# Altium schematic sheet sheet.SchDoc
size A
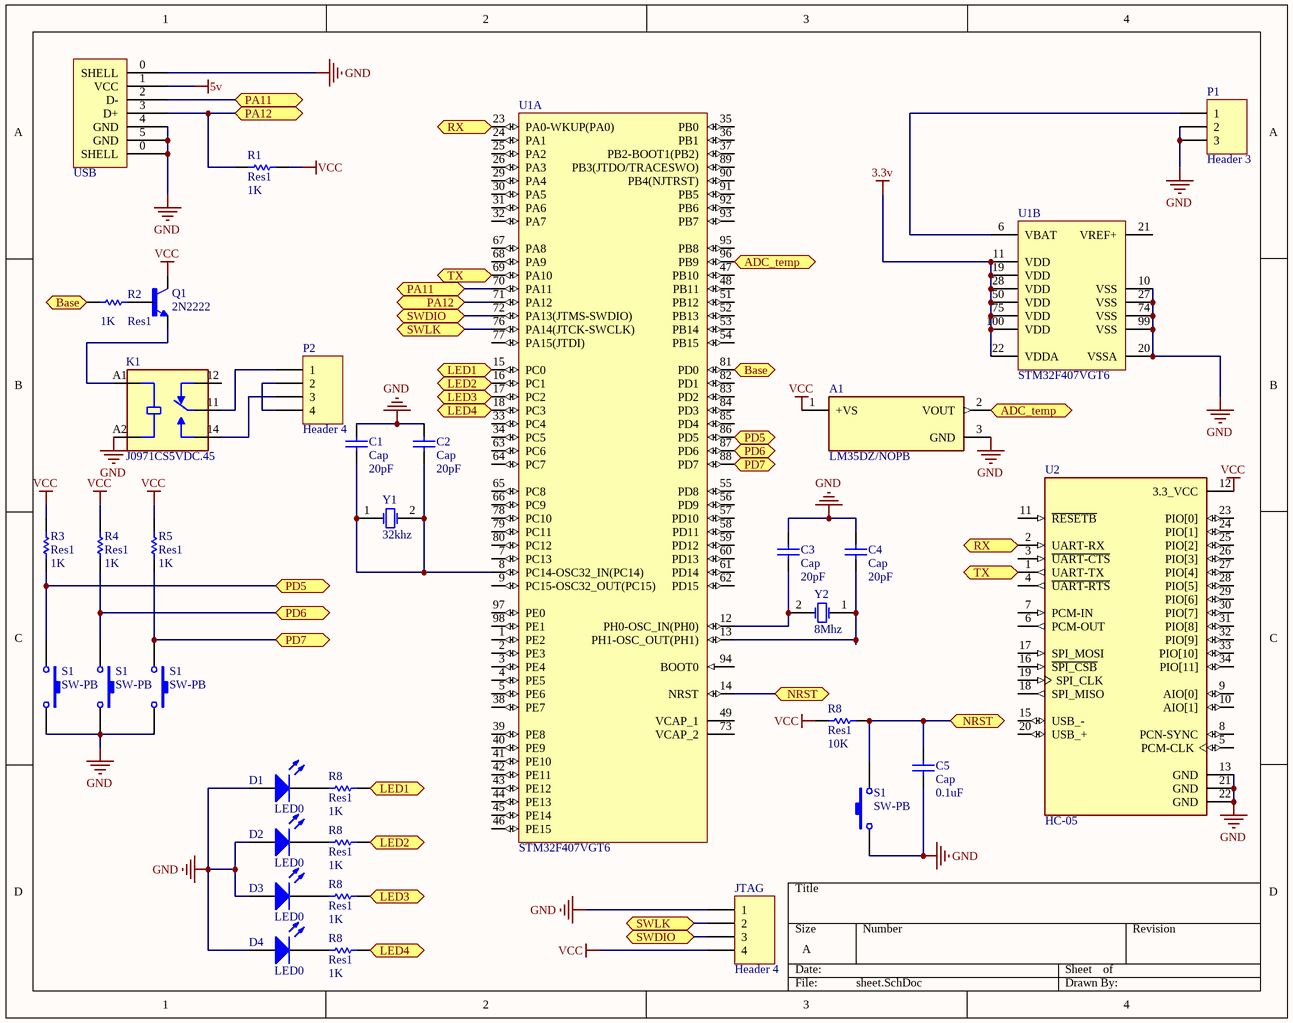
[diagram p0: sheet.SchDoc]

## Parts
(Parts that share a designator on the sheet are numbered #1, #2 ... from top to bottom, then left to right.)
A1  LM35DZ/NOPB  [TO92127P521H735-3]
C1  Cap  value 20pF  [RAD-0.3]
C2  Cap  value 20pF  [RAD-0.3]
C3  Cap  value 20pF  [RAD-0.3]
C4  Cap  value 20pF  [RAD-0.3]
C5  Cap  value 0.1uF  [RAD-0.3]
D1  LED0  [LED-0]
D2  LED0  [LED-0]
D3  LED0  [LED-0]
D4  LED0  [LED-0]
JTAG  Header 4  [HDR1X4]
K1  J0971CS5VDC.45  [RELAY_J0971CS5VDC.45]
P1  Header 3  [HDR1X3]
P2  Header 4  [HDR1X4]
Q1  2N2222  [TO127P584H533-3]
R1  Res1  value 1K  [AXIAL-0.3]
R2  Res1  value 1K  [AXIAL-0.3]
R3  Res1  value 1K  [AXIAL-0.3]
R4  Res1  value 1K  [AXIAL-0.3]
R5  Res1  value 1K  [AXIAL-0.3]
R8#1  Res1  value 10K  [AXIAL-0.3]
R8#2  Res1  value 1K  [AXIAL-0.3]
R8#3  Res1  value 1K  [AXIAL-0.3]
R8#4  Res1  value 1K  [AXIAL-0.3]
R8#5  Res1  value 1K  [AXIAL-0.3]
S1#1  SW-PB  [SPST-2]
S1#2  SW-PB  [SPST-2]
S1#3  SW-PB  [SPST-2]
S1#4  SW-PB  [SPST-2]
U1  STM32F407VGT6  [STM-LQFP100_N]  (parts A,B of 2)
U2  HC-05  [XCVR_HC-05]
USB  USB connector  [usb_B]  (value not drawn)
Y1  32khz  [R38]
Y2  8Mhz  [R38]

## Ports
ADC_temp, Base, LED1, LED2, LED3, LED4, NRST, PA11, PA12, PD5, PD6, PD7, RX, SWDIO, SWLK, TX

## Nets
3.3v: U1.11(VDD) U1.19(VDD) U1.22(VDDA) U1.28(VDD) U1.50(VDD) U1.75(VDD) U1.100(VDD)
5v: USB.1(VCC)
GND: A1.3(GND) C1.1 C2.1 C3.2 C4.2 C5.1 D1.1(A) D2.1(A) D3.1(A) D4.1(A) JTAG.1 K1.A2(COIL2) P1.2 P1.3 S1#1.2 S1#2.2 S1#3.2 S1#4.1 U1.10(VSS) U1.20(VSSA) U1.27(VSS) U1.74(VSS) U1.99(VSS) U2.13(GND) U2.21(GND) U2.22(GND) USB.0(SHELL) USB.4(GND) USB.5(GND)
VCC: A1.1(+VS) JTAG.4 Q1.3(C) R1.2 R3.2 R4.2 R5.2 R8#1.1 U2.12(3.3_VCC)
ADC_temp: A1.2(VOUT) U1.96(PB9) ; port ADC_temp
Base: R2.1 U1.81(PD0) ; port Base
LED1: R8#2.2 U1.15(PC0) ; port LED1
LED2: R8#3.2 U1.16(PC1) ; port LED2
LED3: R8#4.2 U1.17(PC2) ; port LED3
LED4: R8#5.2 U1.18(PC3) ; port LED4
NRST: C5.2 R8#1.2 S1#4.2 U1.14(NRST) ; port NRST
PA11: U1.70(PA11) USB.2(D-) ; port PA11
PA12: R1.1 U1.71(PA12) USB.3(D+) ; port PA12
PD5: R3.1 S1#1.1 U1.86(PD5) ; port PD5
PD6: R4.1 S1#2.1 U1.87(PD6) ; port PD6
PD7: R5.1 S1#3.1 U1.88(PD7) ; port PD7
RX: U1.23(PA0-WKUP(PA0)) U2.2(UART-RX) ; port RX
SWDIO: JTAG.3 U1.72(PA13(JTMS-SWDIO)) ; port SWDIO
SWLK: JTAG.2 U1.76(PA14(JTCK-SWCLK)) ; port SWLK
TX: U1.69(PA10) U2.1(UART-TX) ; port TX
NetC1_2: C1.2 C2.2 U1.8(PC14-OSC32_IN(PC14)) Y1.1(OSC1) Y1.2(OSC2)
NetC3_1: C3.1 U1.12(PH0-OSC_IN(PH0)) Y2.2(OSC2)
NetC4_1: C4.1 U1.13(PH1-OSC_OUT(PH1)) Y2.1(OSC1)
NetD1_2: D1.2(K) R8#2.1
NetD2_2: D2.2(K) R8#3.1
NetD3_2: D3.2(K) R8#4.1
NetD4_2: D4.2(K) R8#5.1
NetK1_11: K1.11(COM) P2.1
NetK1_14: K1.14(NO) P2.3
NetK1_A1: K1.A1(COIL1) Q1.1(E)
NetP1_1: P1.1 U1.6(VBAT)
NetP2_2: P2.2 P2.4
NetQ1_2: Q1.2(B) R2.2

Not connected (* = marked no-connect by the designer): K1 12(NC); U1 1(PE2) 2(PE3) 3(PE4) 4(PE5) 5(PE6) 7(PC13) 9(PC15-OSC32_OUT(PC15)) 21(VREF+) 24(PA1) 25(PA2) 26(PA3) 29(PA4) 30(PA5) 31(PA6) 32(PA7) 33(PC4) 34(PC5) 35(PB0) 36(PB1) 37(PB2-BOOT1(PB2)) 38(PE7) 39(PE8) 40(PE9) 41(PE10) 42(PE11) 43(PE12) 44(PE13) 45(PE14) 46(PE15) 47(PB10) 48(PB11) 49(VCAP_1) 51(PB12) 52(PB13) 53(PB14) 54(PB15) 55(PD8) 56(PD9) 57(PD10) 58(PD11) 59(PD12) 60(PD13) 61(PD14) 62(PD15) 63(PC6) 64(PC7) 65(PC8) 66(PC9) 67(PA8) 68(PA9) 73(VCAP_2) 77(PA15(JTDI)) 78(PC10) 79(PC11) 80(PC12) 82(PD1) 83(PD2) 84(PD3) 85(PD4) 89(PB3(JTDO/TRACESWO)) 90(PB4(NJTRST)) 91(PB5) 92(PB6) 93(PB7) 94(BOOT0) 95(PB8) 97(PE0) 98(PE1); U2 3(~{UART-CTS}) 4(~{UART-RTS}) 5(PCM-CLK) 6(PCM-OUT) 7(PCM-IN) 8(PCN-SYNC) 9(AIO[0]) 10(AIO[1]) 11(~{RESETB}) 15(USB_-) 16(~{SPI_CSB}) 17(SPI_MOSI) 18(SPI_MISO) 19(SPI_CLK) 20(USB_+) 23(PIO[0]) 24(PIO[1]) 25(PIO[2]) 26(PIO[3]) 27(PIO[4]) 28(PIO[5]) 29(PIO[6]) 30(PIO[7]) 31(PIO[8]) 32(PIO[9]) 33(PIO[10]) 34(PIO[11])

## Library data of the parts
A1 = LM35DZ/NOPB: Temperature Sensor Analog, Local 0Â°C ~ 100Â°C 10mV/Â°C TO-92-3; MP: LM35DZ; MF: Texas Instruments; Price: None; Availability: In Stock; Package: E-PKG AXIAL-LEADED-2 ON Semiconductor; Value: *; SnapEDA_Link: https://www.snapeda.com/parts/LM35DZ/Texas+Instruments/view-part/?ref=snap; Purchase-URL: https://pricing.snapeda.com/search/part/LM35DZ/?ref=eda; Check_prices: https://www.snapeda.com/parts/LM35DZ/Texas+Instruments/view-part/?ref=eda
C1-C5 = Cap: Capacitor; Published: 8-Jun-2000; LatestRevisionDate: 17-Jul-2002; LatestRevisionNote: Re-released for DXP Platform.; PackageReference: RAD-0.3; Publisher: Altium Limited; PackageDescription: Radial Cap, Thru-Hole; 2 Leads; 0.3 in Pin Spacing
D1-D4 = LED0: Typical INFRARED GaAs LED; Published: 8-Jun-2000; LatestRevisionDate: 08-Jul-2005; LatestRevisionNote: Mech Layer 1 removed.; PackageReference: LED-0; Publisher: Altium Limited; PackageDescription: LED; 2 Leads
JTAG P2 = Header 4: Header, 4-Pin; LatestRevisionDate: 17-Jul-2002; LatestRevisionNote: Re-released for DXP Platform.; Publisher: Altium Limited
K1 = J0971CS5VDC.45: General Purpose Relay SPDT (1 Form C) 5VDC Coil Through Hole; MF: CIT Relay and Switch; Value: *; SnapEDA_Link: https://www.snapeda.com/parts/J0971CS5VDC.45/CIT+Relay+%2526+Switch/view-part/?ref=snap; MP: J0971CS5VDC.45; Purchase-URL: https://pricing.snapeda.com/search/part/J0971CS5VDC.45/?ref=eda; Check_prices: https://www.snapeda.com/parts/J0971CS5VDC.45/CIT+Relay+%2526+Switch/view-part/?ref=eda; Availability: In Stock; Price: None; Package: None
P1 = Header 3: Header, 3-Pin; LatestRevisionDate: 17-Jul-2002; LatestRevisionNote: Re-released for DXP Platform.; Publisher: Altium Limited
Q1 = 2N2222: Bipolar (BJT) Transistor NPN 50V 800mA 300mW Surface Mount Ceramic SMD; MF: ON Semiconductor; Check_prices: https://www.snapeda.com/parts/2N2222/Onsemi/view-part/?ref=eda; Value: *; Availability: In Stock; MP: 2N2222; Price: None; Package: TO-18 Texas Instruments; SnapEDA_Link: https://www.snapeda.com/parts/2N2222/Onsemi/view-part/?ref=snap; Purchase-URL: https://pricing.snapeda.com/search/part/2N2222/?ref=eda
R1-R5 R8#1-R8#5 = Res1: Resistor; Published: 8-Jun-2000; LatestRevisionDate: 17-Jul-2002; LatestRevisionNote: Re-released for DXP Platform.; PackageReference: AXIAL-0.3; Publisher: Altium Limited; PackageDescription: Axial Device, Thru-Hole; 2 Leads; 0.3 in Pin Spacing
S1#1-S1#4 = SW-PB: Switch; Published: 24-Mar-1999; LatestRevisionDate: 17-Jul-2002; LatestRevisionNote: Re-released for DXP Platform.; PackageReference: SPST-2; Publisher: Altium Limited; PackageDescription: Switch; 2 Leads
U1 = STM32F407VGT6: ARM Cortex-M4 32-bit MCU+FPU, 210 DMIPS, 1024 kB Flash, 192 kB Internal RAM, 82 I/Os, 100-pin LQFP, -40 to 85 degC, Tray; Manufacturer: STMicroelectronics; D/A Converter: 2x12-bit; FLASH Size (Prog) (kB): 1024; I/Os (High Current): 82; Internal RAM Size (kB): 192; Operating Frequency(F) (Processor speed) (MHz): 168; Supply Voltage(Vcc) max (V): 3.6; Supply Voltage(Vcc) min (V): 1.8; DatasheetVersion: Rev. 4; PackageVersion: Rev. 1, 06/2013; PackageReference: LQFP100; PackageDescription: 100-Pin Low Profile Quad Flat Package, 14 x 14 mm Body, 0.5 mm Pitch; Supplier 1: Digi-Key; Supplier Part Number 1: 497-11605-ND; Supplier 2: Farnell; Supplier Part Number 2: 2064368; Supplier 3: Newark; Supplier Part Number 3: 73T2333; Supplier 4: Mouser; Supplier Part Number 4: 511-STM32F407VGT6; Core: ARM Cortex-M4; Packing: Tray; Mounting Technology: Surface Mount; PartNumber: STM32F407VGT6; ComponentLink1Description: Manufacturer URL; ComponentLink1URL: http://www.st.com/web/en/home.html; ComponentLink2Description: Datasheet; ComponentLink2URL: http://www.st.com/st-web-ui/static/active/en/resource/technical/document/datasheet/DM00037051.pdf; ComponentLink3Description: Package Specification; ComponentLink3URL: http://www.st.com/st-web-ui/static/active/en/resource/technical/document/data_brief/DM00071938.pdf
U2 = HC-05: Bluetooth to Serial Port Module; MP: HC-05; Value: *; Price: None; Package: None; Availability: Unavailable
USB = USB-B
Y1 Y2 = XTAL: Crystal Oscillator; Published: 8-Jun-2000; LatestRevisionDate: 17-Jul-2002; LatestRevisionNote: Re-released for DXP Platform.; PackageReference: R38; Publisher: Altium Limited; PackageDescription: Crystal, Thru-Hole; 2 Leads; Body 3.1 x 8.2 mm (Dia.xH)